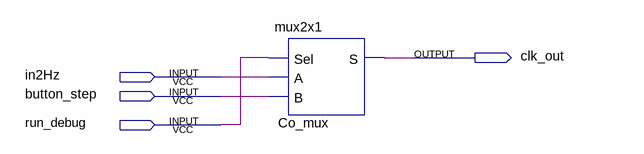
[diagram p0: schematic sheet]
// Quartus schematic run_step_mode.bdf as structural Verilog: 1 symbols, 4 pins
module run_step_mode (
  input  in2Hz,
  input  button_step,
  input  run_debug,
  output clk_out
);

  mux2x1 Co_mux (.Sel(run_debug), .A(in2Hz), .B(button_step), .S(clk_out));
endmodule
